# Altium schematic sheet Misc.SchDoc
size A4; PageSetup: Record=PageOptions|CenterHorizontal=True|CenterVertical=True|PrintScale=0.96|XCorrection=1.00|YCorrection=1.00|PrintKind=2|BorderSize=5000000|LeftOffset=0|BottomOffset=0|Orientation=2|PaperLength=1000|PaperWidth=1000|Scale=100|PaperSource=7|PrintQuality=-4|MediaType=1|DitherType=10|PaperKind=A4|PrintScaleMode=1
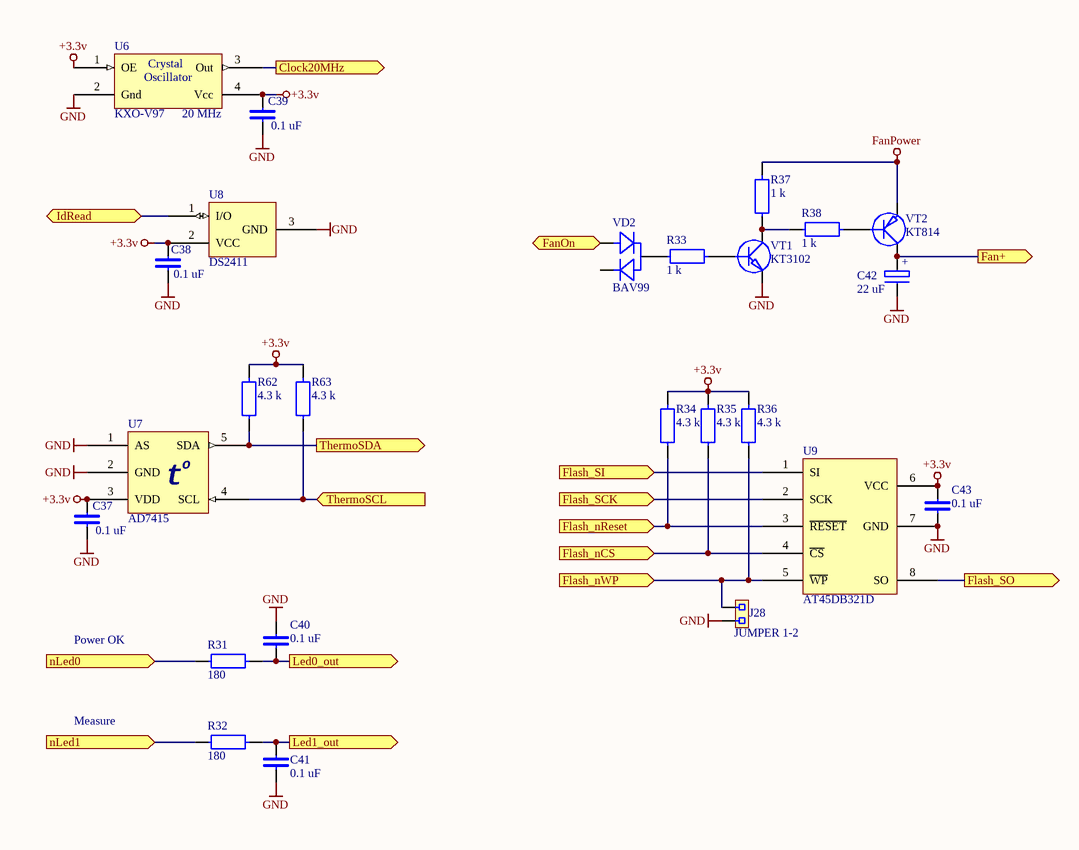
[diagram p0: Misc.SchDoc]

## Parts
C37  0.1 uF  [0603]
C38  0.1 uF  [0603]
C39  0.1 uF  [1206]
C40  0.1 uF  [1206]
C41  0.1 uF  [1206]
C42  22 uF  [CP6032]
C43  0.1 uF  [0603]
J28  JUMPER 1-2  [2SIP]
R31  180  [0805]
R32  180  [0805]
R33  1 k  [1206]
R34  4.3 k  [0603]
R35  4.3 k  [0603]
R36  4.3 k  [0603]
R37  1 k  [1206]
R38  1 k  [1206]
R62  4.3 k  [0603]
R63  4.3 k  [0603]
U6  KXO-V97  [KXO-97]
U7  AD7415  [SOT-23-5]
U8  DS2411  [SOT-23]
U9  AT45DB321D  [8SOIC208]
VD2  BAV99  [SOT-23]
VT1  KT3102  [TRANS-KT3102M]
VT2  KT814  [TRANS-KT814]

## Ports
Clock20MHz (out), Fan+ (out), FanOn (in), Flash_nCS (in), Flash_nReset (in), Flash_nWP (in), Flash_SCK (in), Flash_SI (in), Flash_SO (out), IdRead (bidir), Led0_out (out), Led1_out (out), nLed0 (in), nLed1 (in), ThermoSCL (in), ThermoSDA (out)

## Nets
+3.3v: C37.2 C38.2 C39.2 C43.1 R34.2 R35.2 R36.2 R62.2 R63.2 U6.1(OE) U6.4(Vcc) U7.3(VDD) U8.2(VCC) U9.6(VCC)
FanPower: R37.2 VT2.EMIT
GND: C37.1 C38.1 C39.1 C40.1 C41.2 C42.- C43.2 J28.2 U6.2(Gnd) U7.1(AS) U7.2(GND) U8.3(GND) U9.7(GND) VT1.EMIT
Clock20MHz: U6.3(Out) ; port Clock20MHz
Fan+: C42.+ VT2.COLL ; port Fan+
FanOn: VD2.1 ; port FanOn
Flash_nCS: R35.1 U9.4(~{CS}) ; port Flash_nCS
Flash_nReset: R34.1 U9.3(~{RESET}) ; port Flash_nReset
Flash_nWP: J28.1 R36.1 U9.5(~{WP}) ; port Flash_nWP
Flash_SCK: U9.2(SCK) ; port Flash_SCK
Flash_SI: U9.1(SI) ; port Flash_SI
Flash_SO: U9.8(SO) ; port Flash_SO
IdRead: U8.1(I/O) ; port IdRead
Led0_out: C40.2 R31.2 ; port Led0_out
Led1_out: C41.1 R32.2 ; port Led1_out
nLed0: R31.1 ; port nLed0
nLed1: R32.1 ; port nLed1
ThermoSCL: R63.1 U7.4(SCL) ; port ThermoSCL
ThermoSDA: R62.1 U7.5(SDA) ; port ThermoSDA
NetR33_1: R33.1 VD2.3
NetR33_2: R33.2 VT1.BASE
NetR37_1: R37.1 R38.1 VT1.COLL
NetR38_2: R38.2 VT2.BASE

Not connected (* = marked no-connect by the designer): VD2 2

## Notes on the sheet
- (near U6) 20 MHz
- Power OK
- Measure
- (in symbol AD7415) o; t
- (in symbol SG-636) Crystal; Oscillator

## Library data of the parts
C37-C41 C43 = C
C42 = C POL
J28 = JUMPER 1-2: 2.54 mm jumper
R31-R38 R62 R63 = R
U6 = SG-636: Crystal Oscillator (SMD)
U7 = AD7415: 10-Bit Digital Temperature Sensors
U8 = DS2411: Silicon Serial Number
U9 = AT45DB321D: 32 Mbit data flash memory
VD2 = BAV99: Double diode